# EAGLE design pemasok air (EAGLE 9.2.0)
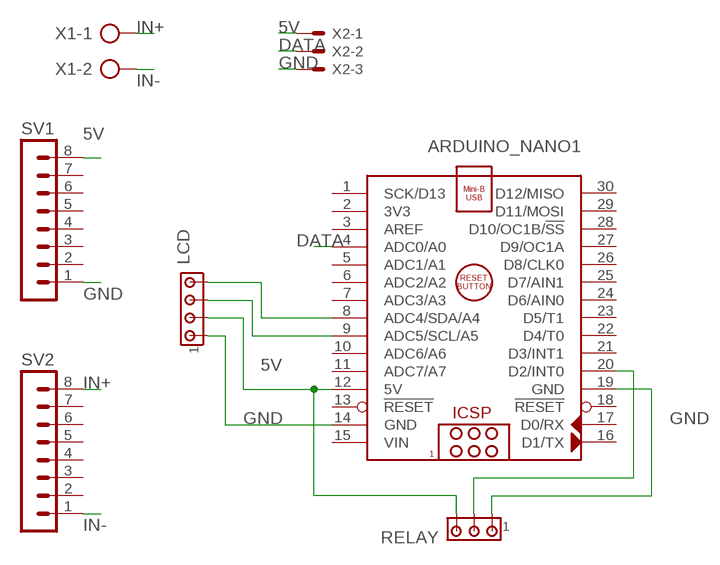
[diagram p0: schematic, sheet 1]

## Parts
ARDUINO_NANO1  ARDUINO_NANO  [ARDUINO_NANO]
LCD  MTA04-100  [10X04MTA]
RELAY  MTA03-100  [10X03MTA]
SV1  MA08-1  [MA08-1]
SV2  MA08-1  [MA08-1]
X1  AK500/2-H  [AK500/2-H]
X2  KK-156-3  [KK-156-3]

## Nets
5V: ARDUINO_NANO1.12(5V) LCD.2 RELAY.3 SV1.8 X2.1
DATA: ARDUINO_NANO1.4(ADC0/A0) X2.2
GND: ARDUINO_NANO1.14(GND) ARDUINO_NANO1.19(GND) LCD.1 RELAY.1 SV1.1 X2.3
IN+: SV2.8 X1.1
IN-: SV2.1 X1.2
N$2: ARDUINO_NANO1.8(ADC4/SDA/A4) LCD.4
N$3: ARDUINO_NANO1.9(ADC5/SCL/A5) LCD.3
N$6: ARDUINO_NANO1.20(D2/INT0) RELAY.2
Unconnected: ARDUINO_NANO1.1(SCK/D13) ARDUINO_NANO1.2(3V3) ARDUINO_NANO1.3(AREF) ARDUINO_NANO1.5(ADC1/A1) ARDUINO_NANO1.6(ADC2/A2) ARDUINO_NANO1.7(ADC3/A3) ARDUINO_NANO1.10(ADC6/A6) ARDUINO_NANO1.11(ADC7/A7) ARDUINO_NANO1.13(!RESET) ARDUINO_NANO1.16(D1/TX) ARDUINO_NANO1.17(D0/RX) ARDUINO_NANO1.18(!RESET) ARDUINO_NANO1.21(D3/INT1) ARDUINO_NANO1.22(D4/T0) ARDUINO_NANO1.23(D5/T1) ARDUINO_NANO1.24(D6/AIN0) ARDUINO_NANO1.25(D7/AIN1) ARDUINO_NANO1.26(D8/CLK0) ARDUINO_NANO1.27(D9/OC1A) ARDUINO_NANO1.28(D10/OC1B/!SS) ARDUINO_NANO1.29(D11/MOSI) ARDUINO_NANO1.30(D12/MISO) SV1.2 SV1.3 SV1.4 SV1.5 SV1.6 SV1.7 SV2.2 SV2.3 SV2.4 SV2.5 SV2.6 SV2.7

## Power pins joined to a net without a drawn wire
VIN: ARDUINO_NANO1.15(VIN)

## Library data of the parts
ARDUINO_NANO1 = ArduinoNanoV30:ARDUINO_NANO: Arduino Nano V3.0 Module Overview: The Arduino Nano is a small, complete, and breadboard-friendly board based on the ATmega328 (Arduino Nano 3.x) or ATmega168 (Arduino Nano 2.x). It has more or less the same functionality of the Arduino Duemilanove, but in a different package. It lacks only a DC power jack, and works with a Mini-B USB cable instead of a standard one. The Nano was designed and is being produced by Gravitech <http://www.gravitech.us/arna30wiatp.html>. General specifications: Item Value Microcontroller Atmel ATmega168 or ATmega328 Operating Voltage (logic level) 5 V Input Voltage (recommended) 7-12 V Input Voltage (limits) 6-20 V Digital I/O Pins 14 (of which 6 provide PWM output) Analog Input Pins 8 DC Current per I/O Pin 40 mA Flash Memory 16 KB (ATmega168) or 32 KB (ATmega328) of which 2 KB used by bootloader SRAM 1 KB (ATmega168) or 2 KB (ATmega328) EEPROM 512 bytes (ATmega168) or 1 KB (ATmega328) Clock Speed 16 MHz Dimensions (Inches) 0.73" x 1.70" Dimensions (mm) 18mm x 45mm Overall height About 9 mm (not including pins) Weigth 5 g Power: The Arduino Nano can be powered via the Mini-B USB connection, 6-20V unregulated external power supply (pin 30), or 5V regulated external power supply (pin 27). The power source is automatically selected to the highest voltage source. Memory: The ATmega168 has 16 KB of flash memory for storing code (of which 2 KB is used for the bootloader); the ATmega328 has 32 KB, (also with 2 KB used for the bootloader). The ATmega168 has 1 KB of SRAM and 512 bytes of EEPROM (which can be read and written with the EEPROM library); the ATmega328 has 2 KB of SRAM and 1 KB of EEPROM. Input and Output: Each of the 14 digital pins on the Nano can be used as an input or output, using pinMode(), digitalWrite(), and digitalRead() functions. They operate at 5 volts. Each pin can provide or receive a maximum of 40 mA and has an internal pull-up resistor (disconnected by default) of 20-50 kOhms. In addition, some pins have specialized functions. Visit Arduino - ArduinoBoardNano <https://www.arduino.cc/en/Main/ArduinoBoardNano>
LCD = con-amp:MTA04-100: AMP connector
RELAY = con-amp:MTA03-100: AMP connector
SV1 SV2 = con-lstb:MA08-1: PIN HEADER; OC_FARNELL: unknown; OC_NEWARK: unknown
X1 = con-ptr500:AK500/2-H: CONNECTOR Aug. 2004 / PTR Meßtechnik: Die Bezeichnung der Serie AK505 wurde geändert. Es handelt sich hierbei um AK500 in horizontaler Ausführung.; OC_FARNELL: unknown; OC_NEWARK: unknown
X2 = con-molex:KK-156-3: KK 156 HEADER Source: http://www.molex.com/pdm_docs/sd/026604100_sd.pdf; MF: MOLEX; OC_FARNELL: unknown; OC_NEWARK: unknown

## Board
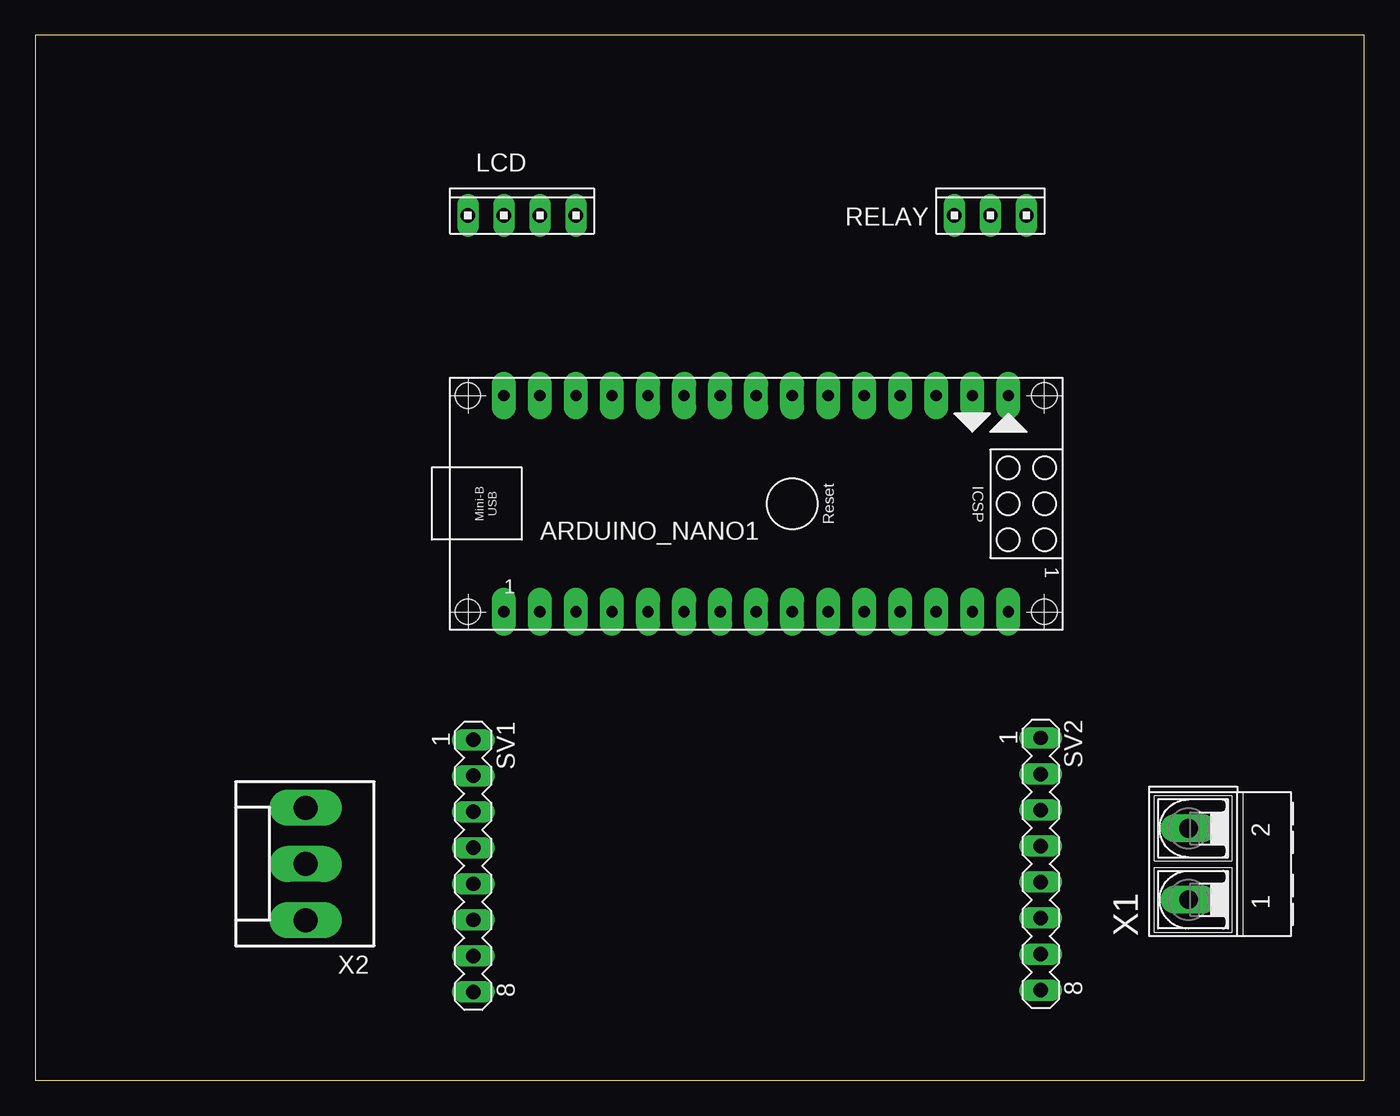
[diagram p1: board, top side]
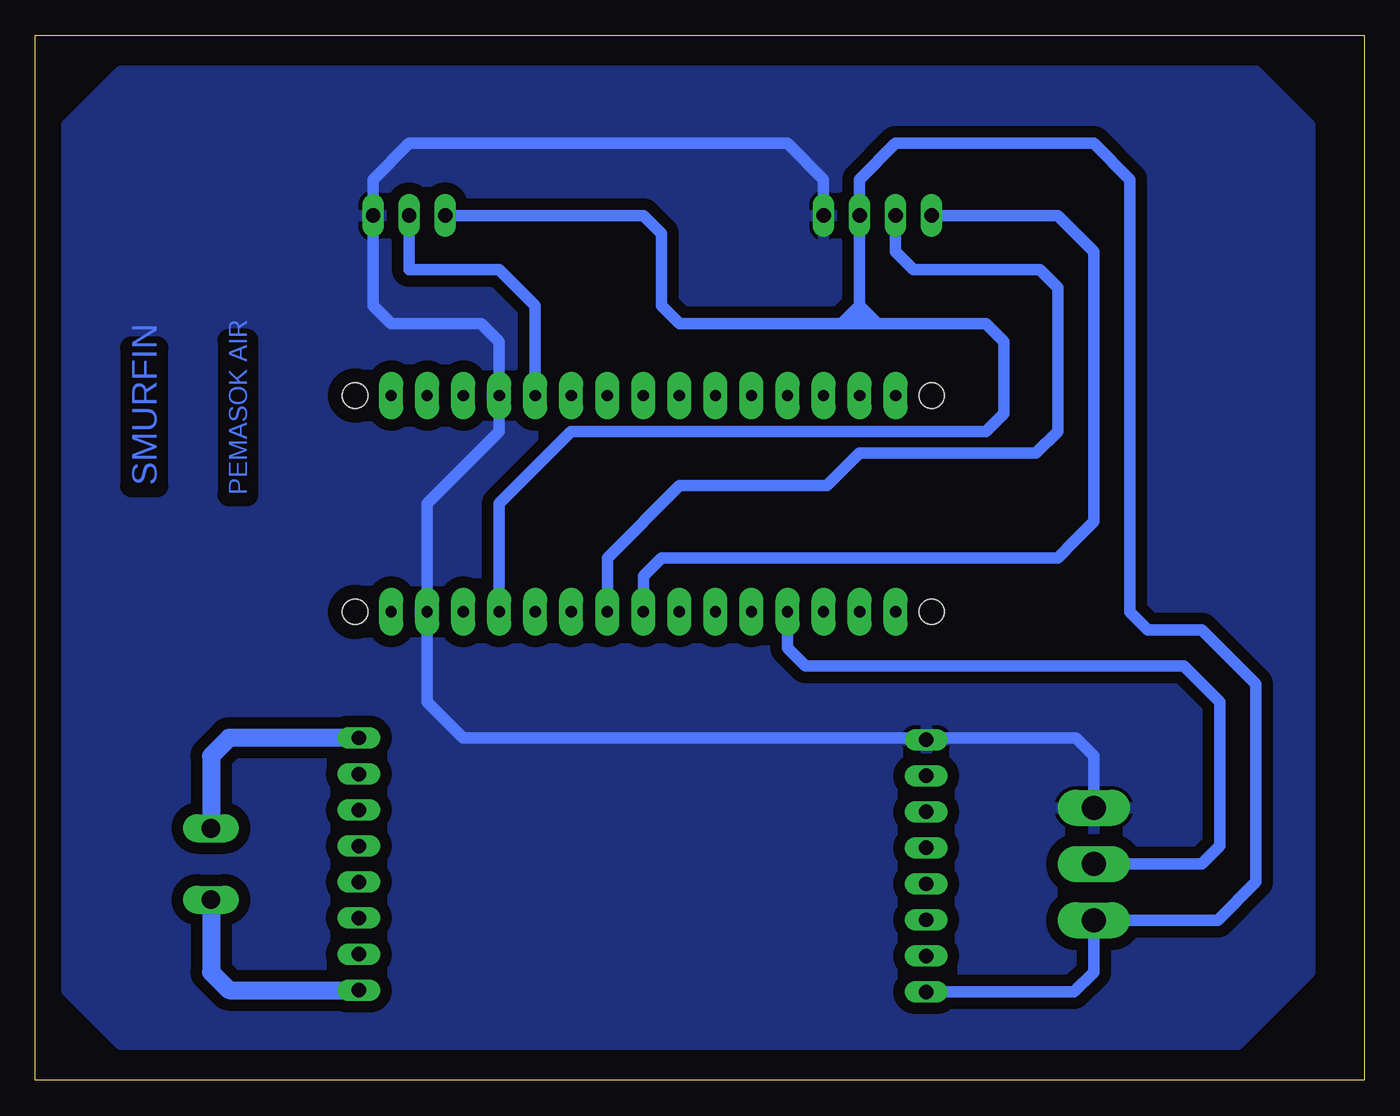
[diagram p2: board, bottom side, seen from below]

Size 93.65 x 73.65 mm. Coordinates in mm from the lower left corner, seen from the top.
Outline: 0,0 93.65,0 93.65,73.65 0,73.65 0,0
Copper layers (1*16): Top 0.035mm / dielectric 1.5mm / Bottom 0.035mm
Design rules "default": minimum track width 6mil, minimum drill 0.35mm, track to track 6mil, track to pad 6mil, pad to pad 6mil, via to via 6mil, smd to smd 6mil, copper to edge 40mil, drill to drill 6mil, minimum pad ring 10mil, minimum via ring 8mil, stop-mask expansion 4mil, vias tented up to drill 0mil, thermal gap 10mil

### Footprints (pad centres in the part's own frame; a part is rotated, then mirrored left to right if it is on the bottom)
ARDUINO_NANO = drill 0.8 pad 1.676 long: 1 -20.32,-7.62; 2 -17.78,-7.62; 3 -15.24,-7.62; 4 -12.7,-7.62; 5 -10.16,-7.62; 6 -7.62,-7.62; 7 -5.08,-7.62; 8 -2.54,-7.62; 9 0,-7.62; 10 2.54,-7.62; 11 5.08,-7.62; 12 7.62,-7.62; 13 10.16,-7.62; 14 12.7,-7.62; 15 15.24,-7.62; 16 15.24,7.62; 17 12.7,7.62; 18 10.16,7.62; 19 7.62,7.62; 20 5.08,7.62; 21 2.54,7.62; 22 0,7.62; 23 -2.54,7.62; 24 -5.08,7.62; 25 -7.62,7.62; 26 -10.16,7.62; 27 -12.7,7.62; 28 -15.24,7.62; 29 -17.78,7.62; 30 -20.32,7.62 | hole 1.778: -22.86,-7.62; -22.86,7.62; 17.78,7.62; 17.78,-7.62
10X04MTA = drill 1.016 long: 1 3.81,0; 2 1.27,0; 3 -1.27,0; 4 -3.81,0
10X03MTA = drill 1.016 long: 1 2.54,0; 2 0,0; 3 -2.54,0
MA08-1 = drill 1.016 long: 1 -8.89,0; 2 -6.35,0; 3 -3.81,0; 4 -1.27,0; 5 1.27,0; 6 3.81,0; 7 6.35,0; 8 8.89,0
AK500/2-H = drill 1.321 long: 1 -2.515,0; 2 2.515,0
KK-156-3 = drill 1.7 pad 2.184 long: 1 -3.96,0; 2 0,0; 3 3.96,0

### Placement (x,y rotation side)
ARDUINO_NANO1  53.34,40.64 0 top
LCD  34.29,60.96 0 top
RELAY  67.31,60.96 0 top
SV1  30.86,15.11 270 top
SV2  70.87,15.24 270 top
X1  81.28,15.24 90 top
X2  19.05,15.24 90 top

### Tracks (layer width: path | path; a pad name or v marks a point on that pad's centre or on a via)
5V
  Bottom 0.813: ARDUINO_NANO1.12 60.96,40.64 55.88,45.72 26.67,45.72 25.4,46.99 25.4,52.07 26.67,53.34 34.29,53.34 | 35.56,54.61 LCD.2 35.56,63.5 33.02,66.04 19.05,66.04 16.51,63.5 16.51,33.02 15.24,31.75 11.43,31.75 7.62,27.94 7.62,13.97 10.31,11.28 X2.1 19.05,7.62 20.45,6.22 SV1.8 | 35.56,53.34 35.56,54.61 | 34.29,53.34 35.56,53.34 | 35.56,53.34 36.83,53.34 | 34.29,53.34 35.56,54.61 | 35.56,54.61 36.83,53.34 | RELAY.3 50.8,60.96 49.53,59.69 49.53,54.61 48.26,53.34 36.83,53.34
DATA
  Bottom 0.813: ARDUINO_NANO1.4 40.64,30.48 39.37,29.21 12.7,29.21 10.16,26.67 10.16,16.51 11.43,15.24 X2.2
GND
  Bottom 0.813: LCD.1 38.1,63.5 40.64,66.04 67.31,66.04 69.85,63.5 RELAY.1 69.85,54.61 68.58,53.34 62.23,53.34 60.96,52.07 ARDUINO_NANO1.19 60.96,45.72 66.04,40.64 ARDUINO_NANO1.14 66.04,26.67 63.5,24.13 30.73,24.13 | X2.3 19.05,22.86 20.32,24.13 30.73,24.13 | 30.73,24.13 SV1.1
  pour Bottom (isolate 0.813): 3.81,67.31 7.62,71.12 87.63,71.12 91.44,67.31 91.44,6.35 87.63,2.54 8.89,2.54 3.81,7.62
IN+
  Bottom 1.27: X1.1 81.28,7.62 80.01,6.35 SV2.8
IN-
  Bottom 1.27: X1.2 81.28,22.86 80.01,24.13 SV2.1
N$2
  Bottom 0.813: ARDUINO_NANO1.8 50.8,35.56 49.53,36.83 21.59,36.83 20.32,38.1 19.05,39.37 19.05,58.42 21.59,60.96 LCD.4
N$3
  Bottom 0.813: ARDUINO_NANO1.9 53.34,36.83 48.26,41.91 37.85,41.91 35.56,44.2 23.11,44.2 21.59,45.72 21.59,55.88 22.86,57.15 31.75,57.15 33.02,58.42 LCD.3
N$6
  Bottom 0.813: ARDUINO_NANO1.20 58.42,54.61 60.96,57.15 66.04,57.15 | RELAY.2 67.31,57.15 66.04,57.15 | 66.04,57.15

### Text on the board
Bottom: SMURFIN | PEMASOK AIR